# EAGLE schematic NixiTubeClock (EAGLE 9.5.2)

## Sheet 1 of 3
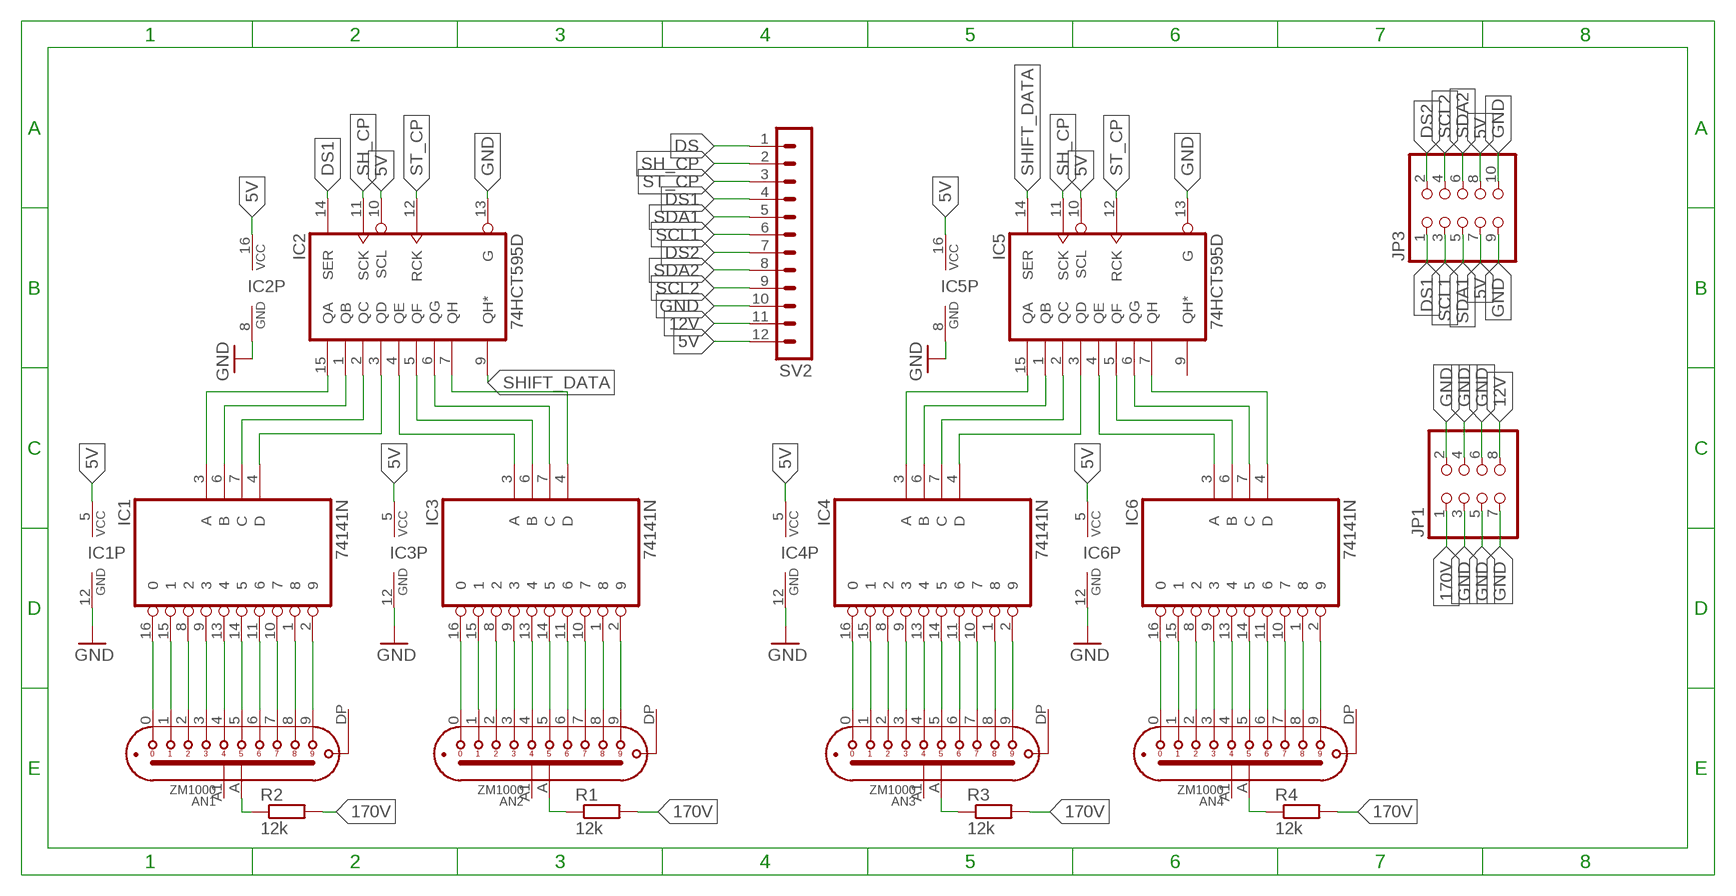
[diagram p0: schematic, sheet 1]

### Parts
AN1  ZM1000  [ZM1000]
AN2  ZM1000  [ZM1000]
AN3  ZM1000  [ZM1000]
AN4  ZM1000  [ZM1000]
IC1  74141N  [DIL16]
IC2  74HCT595D  [SO16]
IC3  74141N  [DIL16]
IC4  74141N  [DIL16]
IC5  74HCT595D  [SO16]
IC6  74141N  [DIL16]
JP1  PINHD-2X4/90  [2X04/90]
JP3  PINHD-2X5/90  [2X05/90]
R1  12k  R-EU_1206R1206  [R1206]
R2  12k  R-EU_1206R1206  [R1206]
R3  12k  R-EU_1206R1206  [R1206]
R4  12k  R-EU_1206R1206  [R1206]
SV2  MA12-1  [MA12-1]

### Nets
5V: IC1.5(VCC) IC2.10(SCL) IC2.16(VCC) IC3.5(VCC) IC4.5(VCC) IC5.10(SCL) IC5.16(VCC) IC6.5(VCC) JP3.7 JP3.8 SV2.12
12V: JP1.8 SV2.11
170V: JP1.1 R1.2 R2.2 R3.2 R4.2
DS: SV2.1
DS1: IC2.14(SER) JP3.1 SV2.4
DS2: JP3.2 SV2.7
GND: IC1.12(GND) IC2.8(GND) IC2.13(G) IC3.12(GND) IC4.12(GND) IC5.8(GND) IC5.13(G) IC6.12(GND) JP1.2 JP1.3 JP1.4 JP1.5 JP1.6 JP1.7 JP3.9 JP3.10 SV2.10
N$1: IC4.4(D) IC5.3(QD)
N$7: AN1.0 IC1.16
N$9: AN1.1 IC1.15
N$13: AN1.2 IC1.8
N$15: AN1.3 IC1.9
N$16: AN1.4 IC1.13
N$17: AN1.5 IC1.14
N$18: AN1.6 IC1.11
N$19: AN1.7 IC1.10
N$20: AN1.8 IC1.1
N$21: AN1.9 IC1.2
N$22: AN2.0 IC3.16
N$23: AN2.1 IC3.15
N$24: AN2.2 IC3.8
N$25: AN2.3 IC3.9
N$26: AN2.4 IC3.13
N$27: AN2.5 IC3.14
N$28: AN2.6 IC3.11
N$29: AN2.7 IC3.10
N$30: AN2.8 IC3.1
N$31: AN2.9 IC3.2
N$32: AN3.0 IC4.16
N$35: AN3.1 IC4.15
N$36: AN3.2 IC4.8
N$66: AN3.3 IC4.9
N$67: AN3.4 IC4.13
N$68: AN3.5 IC4.14
N$69: AN3.6 IC4.11
N$70: AN3.7 IC4.10
N$71: AN3.8 IC4.1
N$72: AN3.9 IC4.2
N$73: AN4.0 IC6.16
N$74: AN4.1 IC6.15
N$75: AN4.2 IC6.8
N$76: AN4.3 IC6.9
N$91: AN4.4 IC6.13
N$92: AN4.5 IC6.14
N$93: AN4.6 IC6.11
N$94: AN4.7 IC6.10
N$95: AN4.8 IC6.1
N$96: AN4.9 IC6.2
N$97: AN1.A(A1) R2.1
N$98: AN2.A(A1) R1.1
N$99: AN3.A(A1) R3.1
N$100: AN4.A(A1) R4.1
N$101: IC1.3(A) IC2.15(QA)
N$102: IC1.6(B) IC2.1(QB)
N$103: IC1.7(C) IC2.2(QC)
N$104: IC1.4(D) IC2.3(QD)
N$105: IC2.4(QE) IC3.3(A)
N$106: IC2.5(QF) IC3.6(B)
N$107: IC2.6(QG) IC3.7(C)
N$108: IC2.7(QH) IC3.4(D)
N$109: IC4.3(A) IC5.15(QA)
N$110: IC4.6(B) IC5.1(QB)
N$111: IC4.7(C) IC5.2(QC)
N$113: IC5.4(QE) IC6.3(A)
N$114: IC5.5(QF) IC6.6(B)
N$115: IC5.6(QG) IC6.7(C)
N$116: IC5.7(QH) IC6.4(D)
SCL1: JP3.3 SV2.6
SCL2: JP3.4 SV2.9
SDA1: JP3.5 SV2.5
SDA2: JP3.6 SV2.8
SH_CP: IC2.11(SCK) IC5.11(SCK) SV2.2
SHIFT_DATA: IC2.9(QH*) IC5.14(SER)
ST_CP: IC2.12(RCK) IC5.12(RCK) SV2.3
Unconnected: AN1.A1(A2) AN1.DP(DPL) AN2.A1(A2) AN2.DP(DPL) AN3.A1(A2) AN3.DP(DPL) AN4.A1(A2) AN4.DP(DPL) IC5.9(QH*)

## Sheet 2 of 3
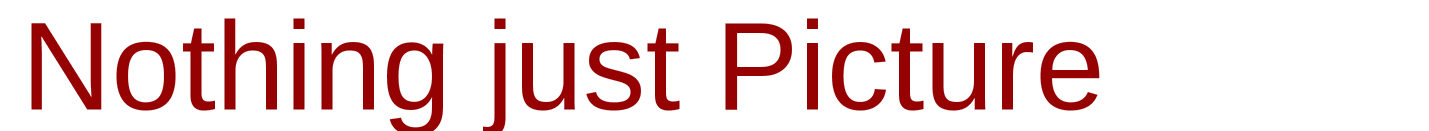
[diagram p1: schematic, sheet 2]

### Notes on the sheet
- Nothing just Picture

## Sheet 3 of 3

## Library data of the parts
AN1-AN4 = NixieTube:ZM1000: Indicator Tube (numeral height 14mm, no filter, side view, long-life typ)
IC1 IC3 IC4 IC6 = NixieTube:74*141: BCD to decimal DECODER/DRIVER
IC2 IC5 = NixieTube:74*595: 8-bit SHIFT REGISTER, output latch
JP1 = pinhead:PINHD-2X4: PIN HEADER
JP3 = pinhead:PINHD-2X5: PIN HEADER
R1-R4 = CommonParts:R-EU_1206: RESISTOR, European symbol
SV2 = con-lstb:MA12-1: PIN HEADER; OC_FARNELL: unknown; OC_NEWARK: unknown

## Net classes
0 default: width 0.2 mm, drill 0.3 mm, clearance 0.1 mm
1 other: width 0.2 mm, drill 0.2 mm, clearance 0.1 mm